# Altium schematic sheet Send.SchDoc
size A; SheetNumber: 3; SheetTotal: 3
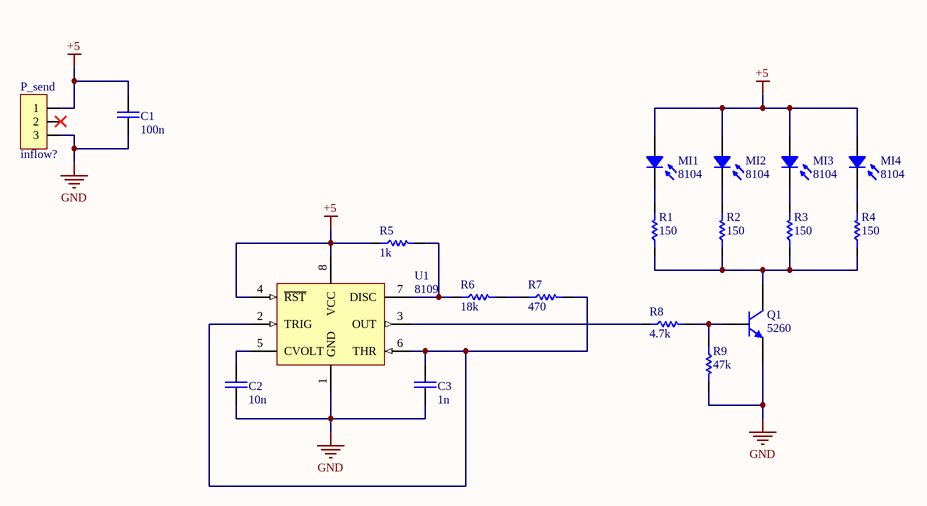
[diagram p0: Send.SchDoc]

## Parts
C1  100n  [CAP 1206/3216]
C2  10n  [CAP 1206/3216]
C3  1n  [CAP 1206/3216]
MI1  Inflow: 8104  [LED-5mm-IR Reciver]  (hidden comment: 5'mm)
MI2  Inflow: 8104  [LED-5mm-IR Reciver]  (hidden comment: 5'mm)
MI3  Inflow: 8104  [LED-5mm-IR Reciver]  (hidden comment: 5'mm)
MI4  Inflow: 8104  [LED-5mm-IR Reciver]  (hidden comment: 5'mm)
P_send  Inflow: inflow?  [MOLEX KK 0022272031]  (hidden comment: 3'Pin)
Q1  Inflow: 5260  [SOT23_N]  (hidden comment: NPN)
R1  150  [RES 1206 (3216X08L)]
R2  150  [RES 1206 (3216X08L)]
R3  150  [RES 1206 (3216X08L)]
R4  150  [RES 1206 (3216X08L)]
R5  1k  [RES 1206 (3216X08L)]
R6  18k  [RES 1206 (3216X08L)]
R7  470  [RES 1206 (3216X08L)]
R8  4.7k  [RES 1206 (3216X08L)]
R9  47k  [RES 1206 (3216X08L)]
U1  Inflow: 8109  [SO8_narrow_n]  (hidden comment: NE555)

## Nets
+5: C1.1 MI1.1 MI2.1 MI3.1 MI4.1 P_send.1 R5.1 U1.4(~{RST}) U1.8(VCC)
GND: C1.2 C2.2 C3.2 P_send.3 Q1.2(E) R9.2 U1.1(GND)
NetC2_1: C2.1 U1.5(CVOLT)
NetC3_1: C3.1 R7.2 U1.2(TRIG) U1.6(THR)
NetMI1_2: MI1.2 R1.2
NetMI2_2: MI2.2 R2.2
NetMI3_2: MI3.2 R3.2
NetMI4_2: MI4.2 R4.2
NetQ1_1: Q1.1(B) R8.2 R9.1
NetQ1_3: Q1.3(C) R1.1 R2.1 R3.1 R4.1
NetR5_2: R5.2 R6.1 U1.7(DISC)
NetR6_2: R6.2 R7.1
NetR8_1: R8.1 U1.3(OUT)

Not connected (* = marked no-connect by the designer): P_send 2*

## Library data of the parts
C1-C3 = Cap_Multi_SMD_1206: Bipolar ceramic capacitor SMD; Inflow: inflow?; Type: MultiLayer; Rating: Rating?; Validation: Valid; Package: 1206
  C1: Value: 100n
  C2: Value: 10n
  C3: Value: 1n
MI1-MI4 = ModSen_IR_Reciever: Infra Red Reciever Photo Diode; Rating: Rating?; Validation: NT; Value: 5'mm; Package: Package?; Type: Type?
P_send = Con_Signal_3: Signal Connector 3'Pin; Rating: Rating?; Validation: Valid; Value: 3'Pin; Package: Package?; Type: Type?
Q1 = Semi_BJT_2N2222_SMD: NPN Switching Transistors; Rating: Rating?; Type: Type?; Validation: Valid; Value: NPN; Package: Package?
R1-R9 = Res_SMD_1206: Resistor; Inflow: inflow?; Rating: 0.25W; Validation: Valid; Package: 1206; Type: 10%
  R1-R4: Value: 150
  R5: Value: 1k
  R6: Value: 18k
  R7: Value: 470
  R8: Value: 4.7k
  R9: Value: 47k
U1 = IC_TIM_NE555_SMD: Astable or monostable operation timer; Rating: Rating?; Validation: Valid; Value: NE555; Package: Package?; Type: Type?